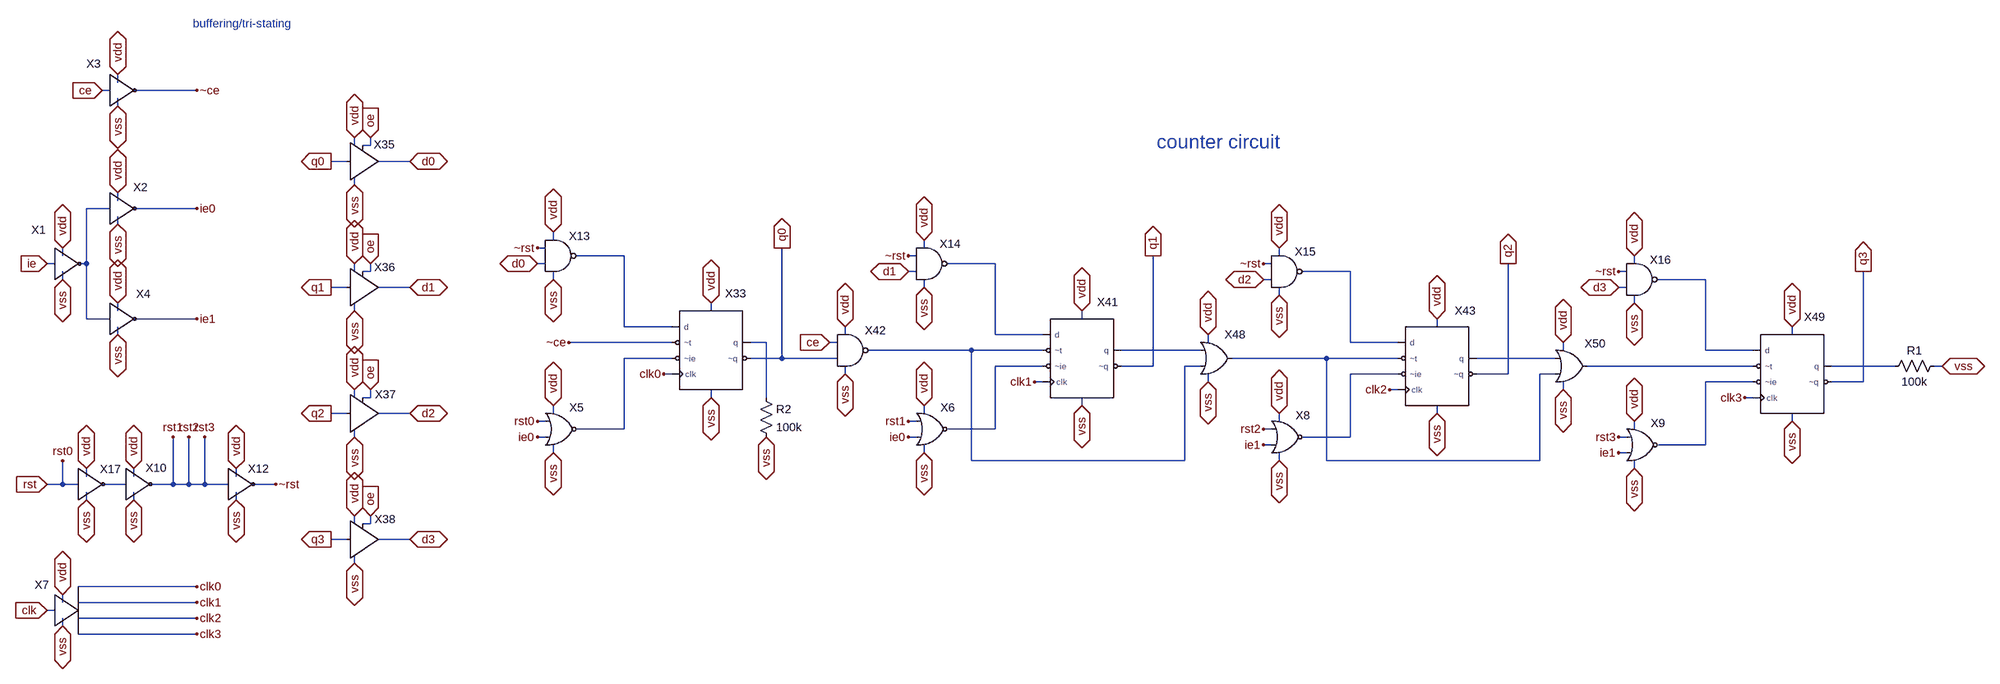
[diagram p0: schematic program_counter.asc]
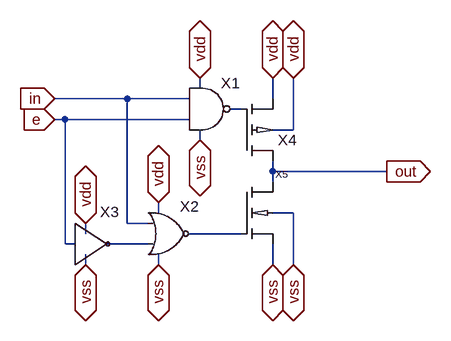
[diagram p1: sub-circuit tri_state_buffer.asc]
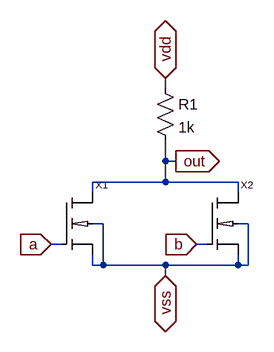
[diagram p2: sub-circuit nor.asc]
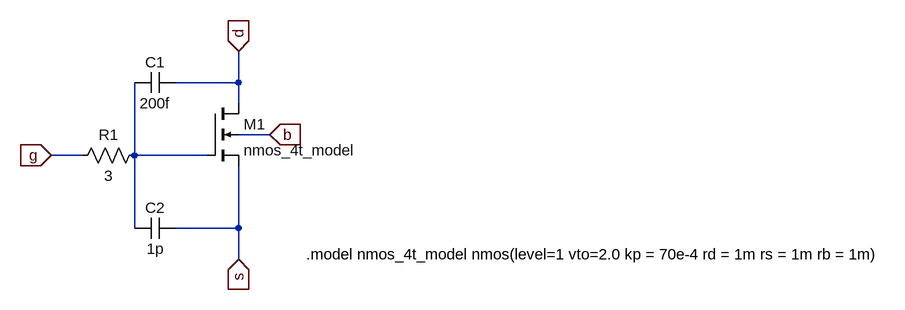
[diagram p3: sub-circuit nmos_4t.asc]
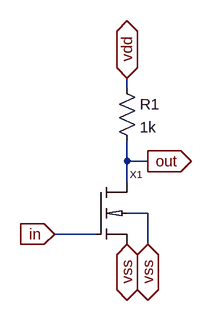
[diagram p4: sub-circuit not.asc]
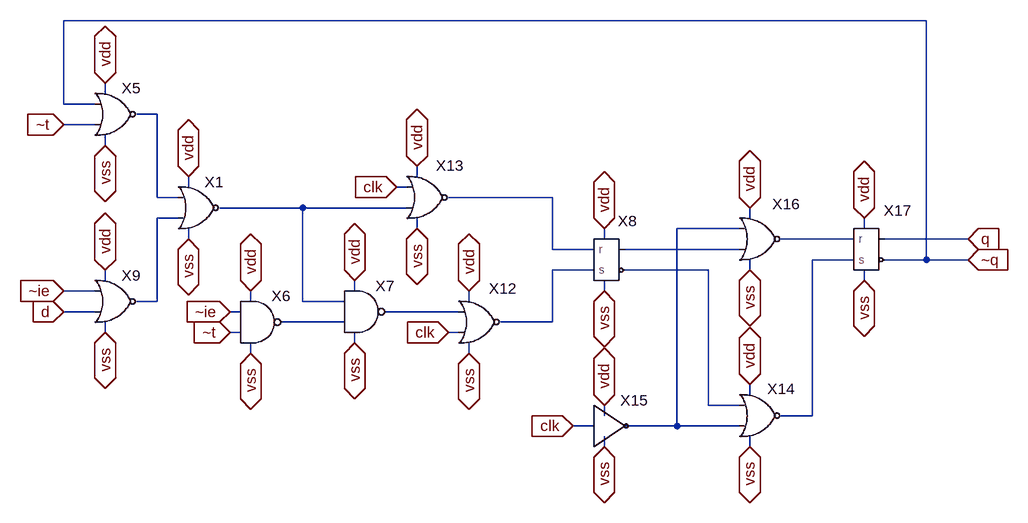
[diagram p5: sub-circuit dt_flip_flop.asc]
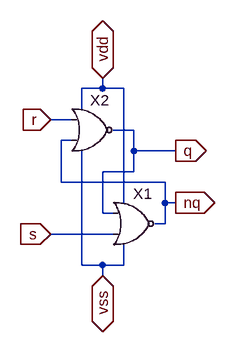
[diagram p6: sub-circuit sr_latch.asc]
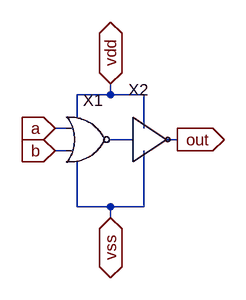
[diagram p7: sub-circuit or.asc]
program_counter.asc, the LTspice schematic file:
Version 4
SHEET 1 3912 2636
WIRE -672 64 -672 48
WIRE -688 80 -704 80
WIRE -512 80 -640 80
WIRE -672 112 -672 96
WIRE -192 192 -192 176
WIRE -160 192 -160 176
WIRE -160 192 -176 192
WIRE -208 224 -240 224
WIRE -80 224 -144 224
WIRE -192 272 -192 256
WIRE -672 304 -672 288
WIRE -688 320 -736 320
WIRE -512 320 -640 320
WIRE -672 352 -672 336
WIRE 304 384 304 368
WIRE 288 400 272 400
WIRE 1056 400 1056 384
WIRE -784 416 -784 400
WIRE 448 416 352 416
WIRE 1040 416 1024 416
WIRE 1776 416 1776 400
WIRE -800 432 -816 432
WIRE -736 432 -736 320
WIRE -736 432 -752 432
WIRE 288 432 272 432
WIRE 1200 432 1104 432
WIRE 1760 432 1744 432
WIRE 2496 432 2496 416
WIRE -192 448 -192 432
WIRE -160 448 -160 432
WIRE -160 448 -176 448
WIRE 1040 448 1024 448
WIRE 1920 448 1824 448
WIRE 2480 448 2464 448
WIRE -784 464 -784 448
WIRE 304 464 304 448
WIRE 1760 464 1744 464
WIRE 2640 464 2544 464
WIRE -208 480 -240 480
WIRE -80 480 -144 480
WIRE 1056 480 1056 464
WIRE 2480 480 2464 480
WIRE 1776 496 1776 480
WIRE 2496 512 2496 496
WIRE -672 528 -672 512
WIRE -192 528 -192 512
WIRE 624 528 624 512
WIRE -736 544 -736 432
WIRE -688 544 -736 544
WIRE -512 544 -640 544
WIRE 1376 544 1376 528
WIRE 448 560 448 416
WIRE 544 560 448 560
WIRE 2096 560 2096 544
WIRE -672 576 -672 560
WIRE 896 576 896 560
WIRE 1200 576 1200 432
WIRE 1296 576 1200 576
WIRE 2816 576 2816 560
WIRE 544 592 336 592
WIRE 736 592 704 592
WIRE 880 592 864 592
WIRE 1632 592 1632 576
WIRE 1920 592 1920 448
WIRE 2016 592 1920 592
WIRE 1152 608 944 608
WIRE 1296 608 1152 608
WIRE 1616 608 1456 608
WIRE 2352 608 2352 592
WIRE 2640 608 2640 464
WIRE 2736 608 2640 608
WIRE 544 624 448 624
WIRE 768 624 768 400
WIRE 768 624 704 624
WIRE 880 624 768 624
WIRE 1872 624 1680 624
WIRE 2016 624 1872 624
WIRE 2336 624 2176 624
WIRE 1296 640 1200 640
WIRE 1520 640 1520 416
WIRE 1520 640 1456 640
WIRE 1616 640 1584 640
WIRE 2736 640 2400 640
WIRE 3024 640 2896 640
WIRE 3120 640 3104 640
WIRE 544 656 528 656
WIRE 896 656 896 640
WIRE 2016 656 1920 656
WIRE 2240 656 2240 432
WIRE 2240 656 2176 656
WIRE 2336 656 2304 656
WIRE 1296 672 1280 672
WIRE 1632 672 1632 656
WIRE 2736 672 2640 672
WIRE 2960 672 2960 448
WIRE 2960 672 2896 672
WIRE 2016 688 2000 688
WIRE 2352 688 2352 672
WIRE -192 704 -192 688
WIRE -160 704 -160 688
WIRE -160 704 -176 704
WIRE 624 704 624 688
WIRE 736 704 736 592
WIRE 2736 704 2720 704
WIRE 1376 720 1376 704
WIRE -208 736 -240 736
WIRE -80 736 -144 736
WIRE 304 736 304 720
WIRE 1056 736 1056 720
WIRE 2096 736 2096 720
WIRE 288 752 272 752
WIRE 1040 752 1024 752
WIRE 1776 752 1776 736
WIRE 2816 752 2816 736
WIRE 448 768 448 624
WIRE 448 768 352 768
WIRE 1200 768 1200 640
WIRE 1200 768 1104 768
WIRE 1760 768 1744 768
WIRE 2496 768 2496 752
WIRE -192 784 -192 768
WIRE 288 784 272 784
WIRE 1040 784 1024 784
WIRE 1920 784 1920 656
WIRE 1920 784 1824 784
WIRE 2480 784 2464 784
WIRE 1760 800 1744 800
WIRE 2640 800 2640 672
WIRE 2640 800 2544 800
WIRE 304 816 304 800
WIRE 1056 816 1056 800
WIRE 2480 816 2464 816
WIRE 1152 832 1152 608
WIRE 1584 832 1584 640
WIRE 1584 832 1152 832
WIRE 1776 832 1776 816
WIRE 1872 832 1872 624
WIRE 2304 832 2304 656
WIRE 2304 832 1872 832
WIRE 2496 848 2496 832
WIRE -736 864 -736 848
WIRE -640 864 -640 848
WIRE -432 864 -432 848
WIRE -784 880 -784 832
WIRE -784 880 -816 880
WIRE -752 880 -784 880
WIRE -656 880 -704 880
WIRE -560 880 -560 784
WIRE -560 880 -608 880
WIRE -528 880 -528 784
WIRE -528 880 -560 880
WIRE -496 880 -496 784
WIRE -496 880 -528 880
WIRE -448 880 -496 880
WIRE -352 880 -400 880
WIRE -736 912 -736 896
WIRE -640 912 -640 896
WIRE -432 912 -432 896
WIRE -192 960 -192 944
WIRE -160 960 -160 944
WIRE -160 960 -176 960
WIRE -208 992 -240 992
WIRE -80 992 -144 992
WIRE -192 1040 -192 1024
WIRE -512 1088 -752 1088
WIRE -784 1120 -784 1104
WIRE -512 1120 -752 1120
WIRE -800 1136 -816 1136
WIRE -512 1152 -752 1152
WIRE -784 1168 -784 1152
WIRE -512 1184 -752 1184
FLAG -80 224 d0
IOPIN -80 224 BiDir
FLAG -80 480 d1
IOPIN -80 480 BiDir
FLAG -80 736 d2
IOPIN -80 736 BiDir
FLAG -80 992 d3
IOPIN -80 992 BiDir
FLAG -192 784 vss
IOPIN -192 784 BiDir
FLAG -192 688 vdd
IOPIN -192 688 BiDir
FLAG -192 432 vdd
IOPIN -192 432 BiDir
FLAG -192 176 vdd
IOPIN -192 176 BiDir
FLAG -192 528 vss
IOPIN -192 528 BiDir
FLAG -192 272 vss
IOPIN -192 272 BiDir
FLAG -192 1040 vss
IOPIN -192 1040 BiDir
FLAG -192 944 vdd
IOPIN -192 944 BiDir
FLAG -160 176 oe
IOPIN -160 176 In
FLAG -160 432 oe
IOPIN -160 432 In
FLAG -160 688 oe
IOPIN -160 688 In
FLAG -160 944 oe
IOPIN -160 944 In
FLAG -704 80 ce
IOPIN -704 80 In
FLAG -672 112 vss
IOPIN -672 112 BiDir
FLAG -672 48 vdd
IOPIN -672 48 BiDir
FLAG -512 80 ~ce
FLAG -816 432 ie
IOPIN -816 432 In
FLAG -784 400 vdd
IOPIN -784 400 BiDir
FLAG -512 320 ie0
FLAG -240 224 q0
IOPIN -240 224 Out
FLAG -240 480 q1
IOPIN -240 480 Out
FLAG -240 736 q2
IOPIN -240 736 Out
FLAG -240 992 q3
IOPIN -240 992 Out
FLAG 336 592 ~ce
FLAG 272 432 d0
IOPIN 272 432 BiDir
FLAG 864 592 ce
IOPIN 864 592 In
FLAG 768 400 q0
IOPIN 768 400 Out
FLAG 1024 448 d1
IOPIN 1024 448 BiDir
FLAG 1520 416 q1
IOPIN 1520 416 Out
FLAG 1744 464 d2
IOPIN 1744 464 BiDir
FLAG 2240 432 q2
IOPIN 2240 432 Out
FLAG 2464 480 d3
IOPIN 2464 480 BiDir
FLAG 2960 448 q3
IOPIN 2960 448 Out
FLAG 624 704 vss
IOPIN 624 704 BiDir
FLAG 896 656 vss
IOPIN 896 656 BiDir
FLAG 1056 480 vss
IOPIN 1056 480 BiDir
FLAG 304 464 vss
IOPIN 304 464 BiDir
FLAG 1376 720 vss
IOPIN 1376 720 BiDir
FLAG 2096 736 vss
IOPIN 2096 736 BiDir
FLAG 1776 496 vss
IOPIN 1776 496 BiDir
FLAG 1632 672 vss
IOPIN 1632 672 BiDir
FLAG 2352 688 vss
IOPIN 2352 688 BiDir
FLAG 2816 752 vss
IOPIN 2816 752 BiDir
FLAG 2496 512 vss
IOPIN 2496 512 BiDir
FLAG 2496 416 vdd
IOPIN 2496 416 BiDir
FLAG 2816 560 vdd
IOPIN 2816 560 BiDir
FLAG 2096 544 vdd
IOPIN 2096 544 BiDir
FLAG 1632 576 vdd
IOPIN 1632 576 BiDir
FLAG 1376 528 vdd
IOPIN 1376 528 BiDir
FLAG 896 560 vdd
IOPIN 896 560 BiDir
FLAG 1056 384 vdd
IOPIN 1056 384 BiDir
FLAG 624 512 vdd
IOPIN 624 512 BiDir
FLAG 304 368 vdd
IOPIN 304 368 BiDir
FLAG 2352 592 vdd
IOPIN 2352 592 BiDir
FLAG 3120 640 vss
IOPIN 3120 640 BiDir
FLAG -784 464 vss
IOPIN -784 464 BiDir
FLAG -672 352 vss
IOPIN -672 352 BiDir
FLAG -672 288 vdd
IOPIN -672 288 BiDir
FLAG -512 544 ie1
FLAG -672 576 vss
IOPIN -672 576 BiDir
FLAG -672 512 vdd
IOPIN -672 512 BiDir
FLAG 1776 400 vdd
IOPIN 1776 400 BiDir
FLAG 736 784 vss
IOPIN 736 784 BiDir
FLAG -816 1136 clk
IOPIN -816 1136 In
FLAG -784 1168 vss
IOPIN -784 1168 BiDir
FLAG -784 1104 vdd
IOPIN -784 1104 BiDir
FLAG -512 1088 clk0
FLAG -512 1120 clk1
FLAG -512 1152 clk2
FLAG -512 1184 clk3
FLAG 528 656 clk0
FLAG 1280 672 clk1
FLAG 2000 688 clk2
FLAG 2720 704 clk3
FLAG 272 784 ie0
FLAG 304 816 vss
IOPIN 304 816 BiDir
FLAG 304 720 vdd
IOPIN 304 720 BiDir
FLAG 1024 784 ie0
FLAG 1056 816 vss
IOPIN 1056 816 BiDir
FLAG 1056 720 vdd
IOPIN 1056 720 BiDir
FLAG 1776 832 vss
IOPIN 1776 832 BiDir
FLAG 1776 736 vdd
IOPIN 1776 736 BiDir
FLAG 1744 800 ie1
FLAG 2496 848 vss
IOPIN 2496 848 BiDir
FLAG 2496 752 vdd
IOPIN 2496 752 BiDir
FLAG 2464 816 ie1
FLAG -640 848 vdd
IOPIN -640 848 BiDir
FLAG -640 912 vss
IOPIN -640 912 BiDir
FLAG 272 400 ~rst
FLAG 272 752 rst0
FLAG 1024 416 ~rst
FLAG -432 912 vss
IOPIN -432 912 BiDir
FLAG -432 848 vdd
IOPIN -432 848 BiDir
FLAG -736 848 vdd
IOPIN -736 848 BiDir
FLAG -736 912 vss
IOPIN -736 912 BiDir
FLAG -816 880 rst
IOPIN -816 880 In
FLAG -784 832 rst0
FLAG -560 784 rst1
FLAG -528 784 rst2
FLAG -496 784 rst3
FLAG -352 880 ~rst
FLAG 1744 432 ~rst
FLAG 2464 448 ~rst
FLAG 1024 752 rst1
FLAG 1744 768 rst2
FLAG 2464 784 rst3
SYMBOL tri_state_buffer -176 224 R0
WINDOW 0 44 -18 Bottom 2
SYMATTR InstName X35
SYMBOL tri_state_buffer -176 480 R0
WINDOW 0 45 -25 Bottom 2
SYMATTR InstName X36
SYMBOL tri_state_buffer -176 736 R0
WINDOW 0 47 -23 Bottom 2
SYMATTR InstName X37
SYMBOL tri_state_buffer -176 992 R0
WINDOW 0 46 -25 Bottom 2
SYMATTR InstName X38
SYMBOL not -688 80 R0
WINDOW 0 -33 -38 Bottom 2
SYMATTR InstName X3
SYMBOL dt_flip_flop 624 624 R0
WINDOW 0 50 -116 Bottom 2
SYMATTR InstName X33
SYMBOL dt_flip_flop 1376 640 R0
WINDOW 0 52 -114 Bottom 2
SYMATTR InstName X41
SYMBOL dt_flip_flop 2096 656 R0
WINDOW 0 57 -113 Bottom 2
SYMATTR InstName X43
SYMBOL nand 912 544 R0
WINDOW 0 24 24 Left 2
SYMATTR InstName X42
SYMBOL or 1648 560 R0
WINDOW 0 17 16 Left 2
SYMATTR InstName X48
SYMBOL dt_flip_flop 2816 672 R0
WINDOW 0 46 -116 Bottom 2
SYMATTR InstName X49
SYMBOL or 2368 576 R0
WINDOW 0 27 18 Left 2
SYMATTR InstName X50
SYMBOL not -800 432 R0
WINDOW 0 -33 -53 Bottom 2
SYMATTR InstName X1
SYMBOL not -688 320 R0
WINDOW 0 62 -28 Bottom 2
SYMATTR InstName X2
SYMBOL not -688 544 R0
WINDOW 0 68 -35 Bottom 2
SYMATTR InstName X4
SYMBOL res 3120 624 R90
WINDOW 0 0 56 VBottom 2
WINDOW 3 32 56 VTop 2
SYMATTR InstName R1
SYMATTR Value 100k
SYMBOL res 720 688 R0
SYMATTR InstName R2
SYMATTR Value 100k
SYMBOL 1_to_4_buffer -784 1136 R0
WINDOW 0 -42 -36 Bottom 2
SYMATTR InstName X7
SYMBOL nor 320 704 R0
WINDOW 0 17 20 Left 2
SYMATTR InstName X5
SYMBOL nor 1072 704 R0
WINDOW 0 17 20 Left 2
SYMATTR InstName X6
SYMBOL nor 1792 720 R0
WINDOW 0 17 20 Left 2
SYMATTR InstName X8
SYMBOL nor 2512 736 R0
WINDOW 0 17 20 Left 2
SYMATTR InstName X9
SYMBOL not -656 880 R0
WINDOW 0 62 -18 Bottom 2
SYMATTR InstName X10
SYMBOL nand 320 352 R0
SYMATTR InstName X13
SYMBOL not -448 880 R0
WINDOW 0 61 -16 Bottom 2
SYMATTR InstName X12
SYMBOL nand 1072 368 R0
SYMATTR InstName X14
SYMBOL nand 1792 384 R0
SYMATTR InstName X15
SYMBOL nand 2512 400 R0
SYMATTR InstName X16
SYMBOL not -752 880 R0
WINDOW 0 65 -15 Bottom 2
SYMATTR InstName X17
TEXT -520 -56 Left 2 ;buffering/tri-stating
TEXT 1528 184 Left 4 ;counter circuit

tri_state_buffer.asc, the sub-circuit schematic file:
Version 4
SHEET 1 880 680
WIRE 112 48 112 32
WIRE 0 64 -112 64
WIRE 96 64 0 64
WIRE 224 64 224 32
WIRE 176 80 160 80
WIRE -96 96 -112 96
WIRE 96 96 -96 96
WIRE 256 112 256 32
WIRE 256 112 224 112
WIRE 112 128 112 112
WIRE 224 176 224 160
WIRE 400 176 224 176
WIRE 224 192 224 176
WIRE 48 240 48 224
WIRE 256 240 224 240
WIRE 0 256 0 64
WIRE 32 256 0 256
WIRE -64 272 -64 256
WIRE 176 272 96 272
WIRE -96 288 -96 96
WIRE -80 288 -96 288
WIRE 32 288 -32 288
WIRE -64 320 -64 304
WIRE 48 320 48 304
WIRE 224 320 224 288
WIRE 256 320 256 240
FLAG -112 64 in
IOPIN -112 64 In
FLAG -112 96 e
IOPIN -112 96 In
FLAG 224 320 vss
IOPIN 224 320 BiDir
FLAG 224 32 vdd
IOPIN 224 32 BiDir
FLAG 400 176 out
IOPIN 400 176 Out
FLAG -64 320 vss
IOPIN -64 320 BiDir
FLAG 48 320 vss
IOPIN 48 320 BiDir
FLAG 112 128 vss
IOPIN 112 128 BiDir
FLAG 112 32 vdd
IOPIN 112 32 BiDir
FLAG 48 224 vdd
IOPIN 48 224 BiDir
FLAG -64 256 vdd
IOPIN -64 256 BiDir
FLAG 256 32 vdd
IOPIN 256 32 BiDir
FLAG 256 320 vss
IOPIN 256 320 BiDir
SYMBOL nand 128 16 R0
SYMATTR InstName X1
SYMBOL nor 64 208 R0
WINDOW 0 17 22 Left 2
SYMATTR InstName X2
SYMBOL not -80 288 R0
WINDOW 0 53 -34 Bottom 2
SYMATTR InstName X3
SYMBOL pmos_4t 176 160 M180
SYMATTR InstName X4
SYMBOL nmos_4t 176 192 R0
SYMATTR InstName X5

nor.asc, the sub-circuit schematic file:
Version 4
SHEET 1 880 680
WIRE 240 48 240 32
WIRE 240 160 240 128
WIRE 256 160 240 160
WIRE 240 192 240 160
WIRE 240 192 128 192
WIRE 352 192 240 192
WIRE 128 208 128 192
WIRE 352 208 352 192
WIRE 144 256 128 256
WIRE 368 256 352 256
WIRE 80 288 64 288
WIRE 304 288 288 288
WIRE 128 320 128 304
WIRE 144 320 144 256
WIRE 144 320 128 320
WIRE 240 320 144 320
WIRE 352 320 352 304
WIRE 352 320 240 320
WIRE 368 320 368 256
WIRE 368 320 352 320
WIRE 240 336 240 320
FLAG 240 32 vdd
IOPIN 240 32 BiDir
FLAG 240 336 vss
IOPIN 240 336 BiDir
FLAG 256 160 out
IOPIN 256 160 Out
FLAG 288 288 b
IOPIN 288 288 In
FLAG 64 288 a
IOPIN 64 288 In
SYMBOL res 224 32 R0
SYMATTR InstName R1
SYMATTR Value 1k
SYMBOL nmos_4t 80 208 R0
SYMATTR InstName X1
SYMBOL nmos_4t 304 208 R0
SYMATTR InstName X2

nmos_4t.asc, the sub-circuit schematic file:
Version 4
SHEET 1 880 680
WIRE -288 -224 -288 -272
WIRE -288 -224 -384 -224
WIRE -288 -192 -288 -224
WIRE -240 -144 -288 -144
WIRE -528 -112 -576 -112
WIRE -448 -112 -448 -224
WIRE -336 -112 -448 -112
WIRE -448 0 -448 -112
WIRE -288 0 -288 -96
WIRE -288 0 -384 0
WIRE -288 48 -288 0
FLAG -576 -112 g
IOPIN -576 -112 In
FLAG -288 -272 d
IOPIN -288 -272 In
FLAG -288 48 s
IOPIN -288 48 In
FLAG -240 -144 b
IOPIN -240 -144 In
SYMBOL nmos4 -336 -192 R0
SYMATTR InstName M1
SYMATTR Value nmos_4t_model
SYMBOL cap -384 -240 R90
WINDOW 0 0 32 VBottom 2
WINDOW 3 32 32 VTop 2
SYMATTR InstName C1
SYMATTR Value 200f
SYMBOL cap -384 -16 R90
WINDOW 0 0 32 VBottom 2
WINDOW 3 32 32 VTop 2
SYMATTR InstName C2
SYMATTR Value 1p
SYMBOL res -432 -128 R90
WINDOW 0 0 56 VBottom 2
WINDOW 3 32 56 VTop 2
SYMATTR InstName R1
SYMATTR Value 3
TEXT -184 40 Left 2 !.model nmos_4t_model nmos(level=1 vto=2.0 kp = 70e-4 rd = 1m rs = 1m rb = 1m)

not.asc, the sub-circuit schematic file:
Version 4
SHEET 1 880 680
WIRE 176 -96 176 -112
WIRE 176 16 176 -16
WIRE 208 16 176 16
WIRE 176 48 176 16
WIRE 208 96 176 96
WIRE 128 128 64 128
WIRE 208 144 208 96
FLAG 64 128 in
IOPIN 64 128 In
FLAG 176 144 vss
IOPIN 176 144 BiDir
FLAG 176 -112 vdd
IOPIN 176 -112 BiDir
FLAG 208 16 out
IOPIN 208 16 Out
FLAG 208 144 vss
IOPIN 208 144 BiDir
SYMBOL res 160 -112 R0
SYMATTR InstName R1
SYMATTR Value 1k
SYMBOL nmos_4t 128 48 R0
SYMATTR InstName X1

dt_flip_flop.asc, the sub-circuit schematic file:
Version 4
SHEET 1 1928 1824
WIRE 1184 -16 -144 -16
WIRE -80 96 -80 80
WIRE -144 112 -144 -16
WIRE -96 112 -144 112
WIRE 0 128 -32 128
WIRE -96 144 -144 144
WIRE -80 176 -80 160
WIRE 400 224 400 208
WIRE 48 240 48 224
WIRE 384 240 368 240
WIRE 0 256 0 128
WIRE 32 256 0 256
WIRE 608 256 448 256
WIRE 224 272 96 272
WIRE 384 272 224 272
WIRE 32 288 0 288
WIRE 912 288 912 272
WIRE 400 304 400 288
WIRE 896 304 800 304
WIRE 1088 304 1088 288
WIRE 48 320 48 304
WIRE 688 320 688 304
WIRE 1072 320 960 320
WIRE 1248 320 1120 320
WIRE 608 336 608 256
WIRE 672 336 608 336
WIRE 896 336 720 336
WIRE 1072 352 1008 352
WIRE 1184 352 1184 -16
WIRE 1184 352 1120 352
WIRE 1248 352 1184 352
WIRE 672 368 608 368
WIRE 848 368 720 368
WIRE 912 368 912 352
WIRE -80 384 -80 368
WIRE 1088 384 1088 368
WIRE -96 400 -144 400
WIRE 304 400 304 384
WIRE 688 400 688 384
WIRE 0 416 0 288
WIRE 0 416 -32 416
WIRE 144 416 144 400
WIRE 224 416 224 272
WIRE 288 416 224 416
WIRE 480 416 480 400
WIRE -96 432 -144 432
WIRE 128 432 112 432
WIRE 464 432 352 432
WIRE 288 448 192 448
WIRE 608 448 608 368
WIRE 608 448 528 448
WIRE -80 464 -80 448
WIRE 128 464 112 464
WIRE 464 464 448 464
WIRE 304 480 304 464
WIRE 144 496 144 480
WIRE 480 496 480 480
WIRE 912 560 912 544
WIRE 848 576 848 368
WIRE 896 576 848 576
WIRE 688 592 688 576
WIRE 1008 592 1008 352
WIRE 1008 592 960 592
WIRE 672 608 640 608
WIRE 800 608 800 304
WIRE 800 608 720 608
WIRE 896 608 800 608
WIRE 688 640 688 624
WIRE 912 640 912 624
FLAG 112 432 ~ie
IOPIN 112 432 In
FLAG 112 464 ~t
IOPIN 112 464 In
FLAG 448 464 clk
IOPIN 448 464 In
FLAG 368 240 clk
IOPIN 368 240 In
FLAG 640 608 clk
IOPIN 640 608 In
FLAG 400 208 vdd
IOPIN 400 208 BiDir
FLAG 480 400 vdd
IOPIN 480 400 BiDir
FLAG 688 304 vdd
IOPIN 688 304 BiDir
FLAG 912 272 vdd
IOPIN 912 272 BiDir
FLAG 1088 288 vdd
IOPIN 1088 288 BiDir
FLAG 912 544 vdd
IOPIN 912 544 BiDir
FLAG 688 576 vdd
IOPIN 688 576 BiDir
FLAG 304 384 vdd
IOPIN 304 384 BiDir
FLAG 144 400 vdd
IOPIN 144 400 BiDir
FLAG 304 480 vss
IOPIN 304 480 BiDir
FLAG 144 496 vss
IOPIN 144 496 BiDir
FLAG 480 496 vss
IOPIN 480 496 BiDir
FLAG 688 400 vss
IOPIN 688 400 BiDir
FLAG 688 640 vss
IOPIN 688 640 BiDir
FLAG 912 640 vss
IOPIN 912 640 BiDir
FLAG 912 368 vss
IOPIN 912 368 BiDir
FLAG 1088 384 vss
IOPIN 1088 384 BiDir
FLAG 400 304 vss
IOPIN 400 304 BiDir
FLAG 1248 320 q
IOPIN 1248 320 In
FLAG 1248 352 ~q
IOPIN 1248 352 In
FLAG -144 432 d
IOPIN -144 432 In
FLAG -144 144 ~t
IOPIN -144 144 In
FLAG 48 224 vdd
IOPIN 48 224 BiDir
FLAG -80 80 vdd
IOPIN -80 80 BiDir
FLAG -80 368 vdd
IOPIN -80 368 BiDir
FLAG -80 176 vss
IOPIN -80 176 BiDir
FLAG -80 464 vss
IOPIN -80 464 BiDir
FLAG 48 320 vss
IOPIN 48 320 BiDir
FLAG -144 400 ~ie
IOPIN -144 400 In
SYMBOL sr_latch 704 352 R0
WINDOW 0 20 -44 Bottom 2
SYMATTR InstName X8
SYMBOL nor 496 384 R0
WINDOW 0 15 12 Left 2
SYMATTR InstName X12
SYMBOL nor 416 192 R0
WINDOW 0 13 15 Left 2
SYMATTR InstName X13
SYMBOL not 672 608 R0
WINDOW 0 62 -24 Bottom 2
SYMATTR InstName X15
SYMBOL nor 928 528 R0
WINDOW 0 11 23 Left 2
SYMATTR InstName X14
SYMBOL nor 928 256 R0
WINDOW 0 19 10 Left 2
SYMATTR InstName X16
SYMBOL sr_latch 1104 336 R0
WINDOW 0 36 -44 Bottom 2
SYMATTR InstName X17
SYMBOL nor 64 208 R0
WINDOW 0 9 24 Left 2
SYMATTR InstName X1
SYMBOL nor -64 64 R0
WINDOW 0 9 24 Left 2
SYMATTR InstName X5
SYMBOL nor -64 352 R0
WINDOW 0 9 24 Left 2
SYMATTR InstName X9
SYMBOL nand 160 384 R0
SYMATTR InstName X6
SYMBOL nand 320 368 R0
SYMATTR InstName X7

sr_latch.asc, the sub-circuit schematic file:
Version 4
SHEET 1 880 680
WIRE 208 0 208 -16
WIRE 208 0 176 0
WIRE 240 0 208 0
WIRE 176 32 176 0
WIRE 160 48 128 48
WIRE 256 64 224 64
WIRE 160 80 144 80
WIRE 256 96 256 64
WIRE 320 96 256 96
WIRE 256 128 256 96
WIRE 256 128 208 128
WIRE 144 144 144 80
WIRE 304 144 144 144
WIRE 240 176 240 0
WIRE 304 176 304 144
WIRE 320 176 304 176
WIRE 208 192 208 128
WIRE 224 192 208 192
WIRE 304 208 304 176
WIRE 304 208 288 208
WIRE 224 224 128 224
WIRE 176 272 176 96
WIRE 208 272 176 272
WIRE 240 272 240 240
WIRE 240 272 208 272
WIRE 208 288 208 272
FLAG 128 224 s
IOPIN 128 224 In
FLAG 128 48 r
IOPIN 128 48 In
FLAG 320 96 q
IOPIN 320 96 Out
FLAG 320 176 nq
IOPIN 320 176 Out
FLAG 208 288 vss
IOPIN 208 288 BiDir
FLAG 208 -16 vdd
IOPIN 208 -16 BiDir
SYMBOL nor 256 144 R0
WINDOW 0 -1 18 Left 2
SYMATTR InstName X1
SYMBOL nor 192 0 R0
WINDOW 0 -3 18 Left 2
SYMATTR InstName X2

or.asc, the sub-circuit schematic file:
Version 4
SHEET 1 880 680
WIRE 176 80 176 64
WIRE 176 80 128 80
WIRE 224 80 176 80
WIRE 128 112 128 80
WIRE 112 128 96 128
WIRE 224 128 224 80
WIRE 208 144 176 144
WIRE 272 144 256 144
WIRE 112 160 96 160
WIRE 128 240 128 176
WIRE 176 240 128 240
WIRE 224 240 224 160
WIRE 224 240 176 240
WIRE 176 256 176 240
FLAG 272 144 out
IOPIN 272 144 Out
FLAG 176 64 vdd
IOPIN 176 64 BiDir
FLAG 176 256 vss
IOPIN 176 256 BiDir
FLAG 96 128 a
IOPIN 96 128 In
FLAG 96 160 b
IOPIN 96 160 In
SYMBOL nor 144 80 R0
SYMATTR InstName X1
SYMBOL not 208 144 R0
SYMATTR InstName X2
SYMATTR Value ""

1_to_4_buffer.asc, the sub-circuit schematic file:
Version 4
SHEET 1 880 680
WIRE -96 128 -144 128
WIRE -288 160 -288 144
WIRE -192 160 -192 144
WIRE -96 160 -144 160
WIRE -304 176 -352 176
WIRE -208 176 -256 176
WIRE -96 192 -144 192
WIRE -288 208 -288 192
WIRE -192 208 -192 192
WIRE -96 224 -144 224
FLAG -352 176 in
IOPIN -352 176 In
FLAG -96 128 out0
IOPIN -96 128 In
FLAG -96 160 out1
IOPIN -96 160 In
FLAG -96 192 out2
IOPIN -96 192 In
FLAG -96 224 out3
IOPIN -96 224 In
FLAG -192 144 vdd
IOPIN -192 144 BiDir
FLAG -192 208 vss
IOPIN -192 208 BiDir
FLAG -288 208 vss
IOPIN -288 208 BiDir
FLAG -288 144 vdd
IOPIN -288 144 BiDir
SYMBOL 1_to_4_not -192 176 R0
WINDOW 0 -36 -22 Bottom 2
SYMATTR InstName X5
SYMBOL not -304 176 R0
WINDOW 0 -21 -16 Bottom 2
SYMATTR InstName X6

1_to_4_not.asc, the sub-circuit schematic file:
Version 4
SHEET 1 880 680
WIRE 112 -16 48 -16
WIRE 144 -16 144 -32
WIRE 144 -16 112 -16
WIRE 176 -16 144 -16
WIRE 240 -16 176 -16
WIRE 48 16 48 -16
WIRE 32 32 -16 32
WIRE 368 32 80 32
WIRE 112 112 112 -16
WIRE -16 128 -16 32
WIRE 96 128 -16 128
WIRE 368 128 144 128
WIRE -16 176 -16 128
WIRE -16 176 -64 176
WIRE 176 208 176 -16
WIRE -16 224 -16 176
WIRE 160 224 -16 224
WIRE 368 224 208 224
WIRE 240 304 240 -16
WIRE -16 320 -16 224
WIRE 224 320 -16 320
WIRE 368 320 272 320
WIRE 48 368 48 48
WIRE 112 368 112 144
WIRE 112 368 48 368
WIRE 144 368 112 368
WIRE 176 368 176 240
WIRE 176 368 144 368
WIRE 240 368 240 336
WIRE 240 368 176 368
WIRE 144 384 144 368
FLAG -64 176 in
IOPIN -64 176 In
FLAG 368 32 out0
IOPIN 368 32 In
FLAG 368 128 out1
IOPIN 368 128 In
FLAG 368 224 out2
IOPIN 368 224 In
FLAG 368 320 out3
IOPIN 368 320 In
FLAG 144 384 vss
IOPIN 144 384 BiDir
FLAG 144 -32 vdd
IOPIN 144 -32 BiDir
SYMBOL not 32 32 R0
SYMATTR InstName X1
SYMBOL not 96 128 R0
SYMATTR InstName X2
SYMBOL not 160 224 R0
SYMATTR InstName X3
SYMBOL not 224 320 R0
SYMATTR InstName X4

The netlist it stands for:
* program_counter.asc
XX35 q0 d0 vss vdd oe tri_state_buffer
XX36 q1 d1 vss vdd oe tri_state_buffer
XX37 q2 d2 vss vdd oe tri_state_buffer
XX38 q3 d3 vss vdd oe tri_state_buffer
XX3 ce ~ce vss vdd not
XX33 N002 N009 N006 ~ce clk0 vdd vss q0 dt_flip_flop
XX41 N003 N012 N008 N007 clk1 vdd vss q1 dt_flip_flop
XX43 N004 N015 N011 N010 clk2 vdd vss q2 dt_flip_flop
XX42 ce q0 vdd vss N007 nand  ; pins a b vdd vss out
XX48 N008 N007 N010 vdd vss or
XX49 N005 N016 N014 N013 clk3 vdd vss q3 dt_flip_flop
XX50 N011 N010 N013 vdd vss or
XX1 ie N001 vss vdd not
XX2 N001 ie0 vss vdd not
XX4 N001 ie1 vss vdd not
R1 vss N014 100k
R2 N006 vss 100k
XX7 clk clk0 clk1 clk2 clk3 vss vdd 1_to_4_buffer
XX5 rst ie0 vdd vss N009 nor
XX6 rst3 ie0 vdd vss N012 nor
XX8 rst3 ie1 vdd vss N015 nor
XX9 rst3 ie1 vdd vss N016 nor
XX10 N017 rst3 vss vdd not
XX13 ~rst d0 vdd vss N002 nand  ; pins a b vdd vss out
XX12 rst3 ~rst vss vdd not
XX14 ~rst d1 vdd vss N003 nand  ; pins a b vdd vss out
XX15 ~rst d2 vdd vss N004 nand  ; pins a b vdd vss out
XX16 ~rst d3 vdd vss N005 nand  ; pins a b vdd vss out
XX17 rst N017 vss vdd not

* block symbol definitions
.subckt tri_state_buffer in out vss vdd e
XX1 in e vdd vss N001 nand  ; pins a b vdd vss out
XX2 in N003 vdd vss N002 nor
XX3 e N003 vss vdd not
XX4 out N001 vdd vdd pmos_4t  ; pins D G S B
XX5 out N002 vss vss nmos_4t
.ends tri_state_buffer

.subckt nor a b vdd vss out
R1 vdd out 1k
XX1 out a vss vss nmos_4t
XX2 out b vss vss nmos_4t
.ends nor

.subckt nmos_4t D G S B
M1 d N001 s b nmos_4t_model
C1 d N001 200f
C2 s N001 1p
R1 N001 g 3
.model nmos_4t_model nmos(level=1 vto=2.0 kp = 70e-4 rd = 1m rs = 1m rb = 1m)
.ends nmos_4t

.subckt not in out vss vdd
R1 vdd out 1k
XX1 out in vss vss nmos_4t
.ends not

.subckt dt_flip_flop d ~ie q ~t clk vdd vss ~q
XX8 N002 N009 N010 N007 vdd vss sr_latch
XX12 N011 clk vdd vss N009 nor
XX13 clk N003 vdd vss N002 nor
XX15 clk N005 vss vdd not
XX14 N010 N005 vdd vss N008 nor
XX16 N005 N007 vdd vss N006 nor
XX17 N006 N008 ~q q vdd vss sr_latch
XX1 N001 N004 vdd vss N003 nor
XX5 ~q ~t vdd vss N001 nor
XX9 ~ie d vdd vss N004 nor
XX6 ~ie ~t vdd vss N012 nand  ; pins a b vdd vss out
XX7 N003 N012 vdd vss N011 nand  ; pins a b vdd vss out
.ends dt_flip_flop

.subckt sr_latch r s nq q vdd vss
XX1 q s vdd vss nq nor
XX2 r nq vdd vss q nor
.ends sr_latch

.subckt or a b out vdd vss
XX1 a b vdd vss N001 nor
XX2 N001 out vss vdd not
.ends or

.subckt 1_to_4_buffer in out0 out1 out2 out3 vss vdd
XX5 N001 out0 out1 out2 out3 vss vdd 1_to_4_not
XX6 in N001 vss vdd not
.ends 1_to_4_buffer

.subckt 1_to_4_not in out0 out1 out2 out3 vss vdd
XX1 in out0 vss vdd not
XX2 in out1 vss vdd not
XX3 in out2 vss vdd not
XX4 in out3 vss vdd not
.ends 1_to_4_not

.model NMOS NMOS
.model PMOS PMOS
.lib standard.mos
* buffering/tri-stating
* counter circuit
.backanno
.end